# EAGLE design 4P-18650-Mod-PCB (EAGLE 9.5.2)
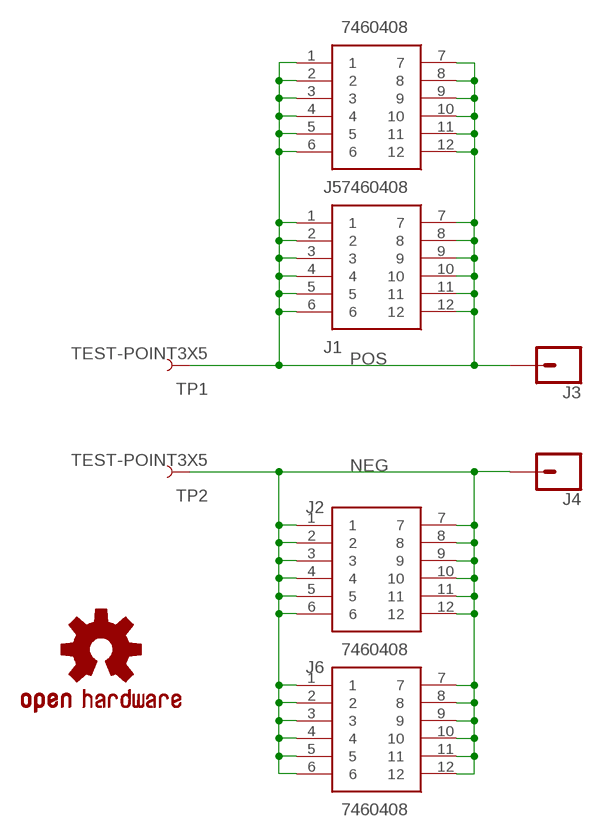
[diagram p0: schematic, sheet 1]

## Parts
J1  7460408  [7460408]
J2  7460408  [7460408]
J3  CONN_01  [1X01]
J4  CONN_01  [1X01]
J5  7460408  [7460408]
J6  7460408  [7460408]
LOGO1  OSHW-LOGOL  [OSHW-LOGO-L]
TP1  TEST-POINT3X5  [PAD.03X.05]
TP2  TEST-POINT3X5  [PAD.03X.05]

## Nets
NEG: J2.1 J2.2 J2.3 J2.4 J2.5 J2.6 J2.7 J2.8 J2.9 J2.10 J2.11 J2.12 J4.1 J6.1 J6.2 J6.3 J6.4 J6.5 J6.6 J6.7 J6.8 J6.9 J6.10 J6.11 J6.12 TP2.P$1
POS: J1.1 J1.2 J1.3 J1.4 J1.5 J1.6 J1.7 J1.8 J1.9 J1.10 J1.11 J1.12 J3.1 J5.1 J5.2 J5.3 J5.4 J5.5 J5.6 J5.7 J5.8 J5.9 J5.10 J5.11 J5.12 TP1.P$1

## Library data of the parts
J1 J2 J5 J6 = SamacSys_Parts:7460408: Wurth Elektronik REDCUBE 12 Pin Power Element, 175A, Press Fit, M5, Vertical Source: Datasheet <https://componentsearchengine.com/Datasheets/1/7460408.pdf>; DESCRIPTION: Wurth Elektronik REDCUBE 12 Pin Power Element, 175A, Press Fit, M5, Vertical; HEIGHT: 6mm; MANUFACTURER_NAME: Wurth Elektronik; MANUFACTURER_PART_NUMBER: 7460408; MOUSER_PART_NUMBER: 710-7460408; MOUSER_PRICE-STOCK: https://www.mouser.com/Search/Refine.aspx?Keyword=710-7460408
J3 J4 = SparkFun-Connectors:CONN_01: Single connection point. Often used as Generic Header-pin footprint for 0.1 inch spaced/style header connections On any of the 0.1 inch spaced packages, you can populate with these: Break Away Headers - Straight <https://www.sparkfun.com/products/116> (PRT-00116) Break Away Male Headers - Right Angle <https://www.sparkfun.com/products/553> (PRT-00553) Female Headers <https://www.sparkfun.com/products/115> (PRT-00115) Break Away Headers - Machine Pin <https://www.sparkfun.com/products/117> (PRT-00117) Break Away Female Headers - Swiss Machine Pin <https://www.sparkfun.com/products/743> (PRT-00743) This device is also useful as a general connection point to wire up your design to another part of your project. Our various solder wires solder well into these plated through hole pads. Hook-Up Wire - Assortment (Stranded, 22 AWG) <https://www.sparkfun.com/products/11375> (PRT-11375) Hook-Up Wire - Assortment (Solid Core, 22 AWG) <https://www.sparkfun.com/products/11367> (PRT-11367) View the entire wire category on our website here <https://www.sparkfun.com/categories/141> Special notes: SMTSO-256-ET is a "flush mount" nut for a 4-40 screw. We mostly use this on specialty testbeds; it is a nice way to connect hardware to your PCB at an adjustable hieght. Also note, the SNAP packages are for using a snappable style connector. We sell a baggie of snaps and they are also used on two LilyPad designs: Snap Assortment - 30 pack (male and female) <https://www.sparkfun.com/products/11347> (DEV-11347) LilyPad Arduino SimpleSnap <https://www.sparkfun.com/products/10941> (DEV-10941) LilyPad SimpleSnap Protoboard <https://www.sparkfun.com/products/10940> (DEV-10940)
LOGO1 = SparkFun-Aesthetics:OSHW-LOGO: Open-Source Hardware (OSHW) Logo This logo indicates the piece of hardware it is found on incorporates a OSHW license and/or adheres to the definition of open source hardware found here: http://freedomdefined.org/OSHW
TP1 TP2 = SparkFun-Connectors:TEST-POINT: SparkFun Test Points Bare copper test points for troubleshooting or In-Circuit-Testing. These are used by our Production team for verifying production board runs using pogo-pins on test beds. SparkFun Products: SparkFun LSM9DS1 Breakout <https://www.sparkfun.com/products/13284> SparkFun PSOC <https://www.sparkfun.com/products/13714> SparkFun Load Cell Amplifier <https://www.sparkfun.com/products/13879>

## Board
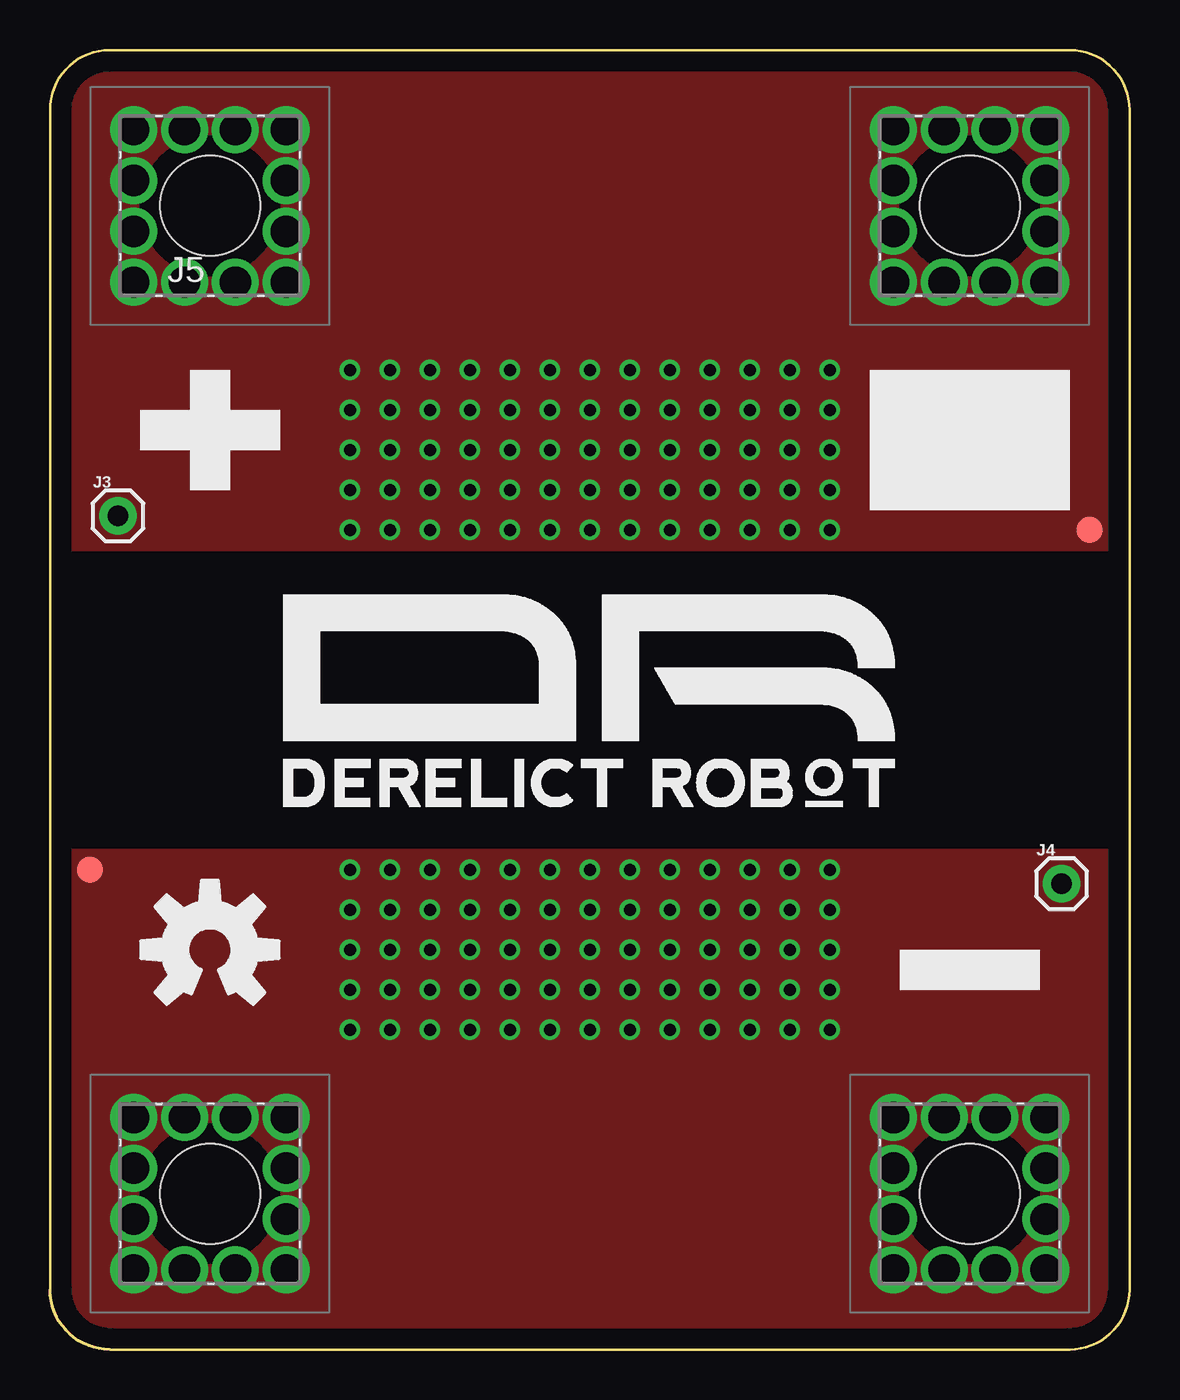
[diagram p1: board, top side]
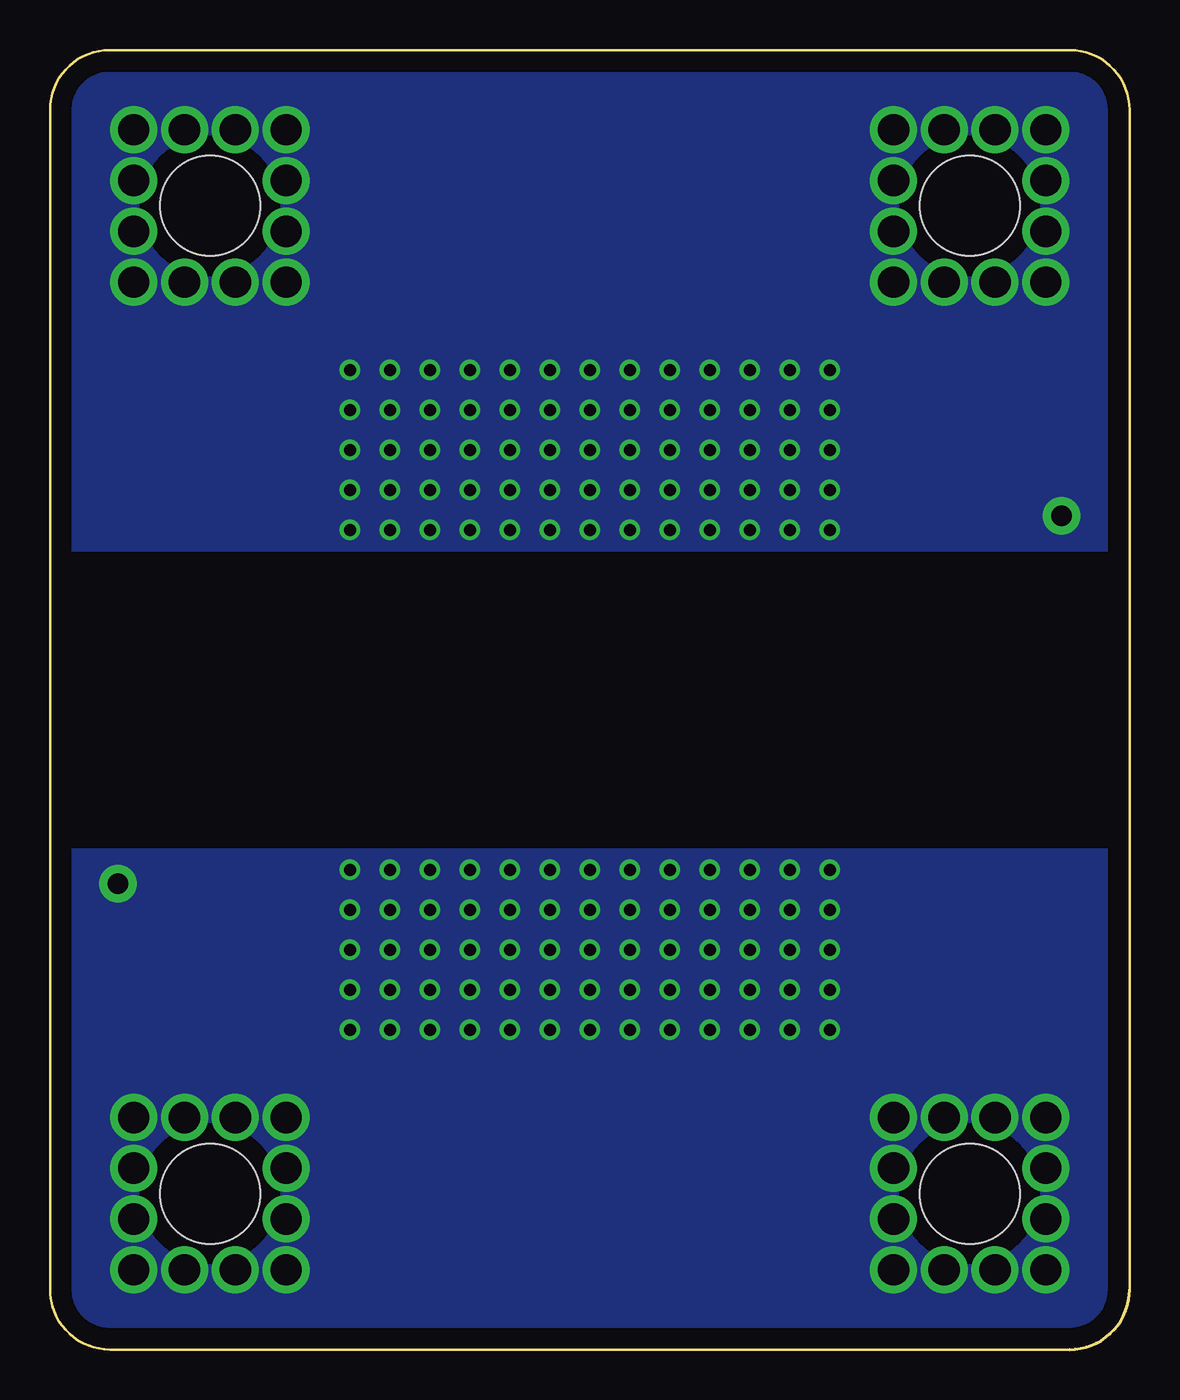
[diagram p2: board, bottom side, seen from below]

Size 54 x 65 mm. Coordinates in mm from the lower left corner, seen from the top.
Outline: 0,62 arc-90 3,65 51,65 arc-90 54,62 54,3 arc-90 51,0 3,0 arc-90 0,3 0,62
Copper layers (1*16): Top 0.035mm / dielectric 1.5mm / Bottom 0.035mm
Design rules "default": minimum track width 6mil, minimum drill 0.35mm, track to track 6mil, track to pad 6mil, pad to pad 6mil, via to via 6mil, smd to smd 6mil, copper to edge 40mil, drill to drill 6mil, minimum pad ring 10mil, minimum via ring 8mil, stop-mask expansion 4mil, vias tented up to drill 0mil, thermal gap 10mil

### Footprints (pad centres in the part's own frame; a part is rotated, then mirrored left to right if it is on the bottom)
7460408 = drill 1.57 pad 2.3: 1 -3.81,-3.81; 2 -1.27,-3.81; 3 1.27,-3.81; 4 3.81,-3.81; 5 3.81,-1.27; 6 3.81,1.27; 7 3.81,3.81; 8 1.27,3.81; 9 -1.27,3.81; 10 -3.81,3.81; 11 -3.81,1.27; 12 -3.81,-1.27 | hole 5: 0,0
1X01 = drill 1.016 pad 1.88: 1 0,0
PAD.03X.05 = smd 1.27 x 1.27: P$1 0,0

### Placement (x,y rotation side)
J1  46,57.2 0 top
J2  46,7.8 180 top
J3  3.4,41.7 0 top
J4  50.6,23.3 0 top
J5  8,57.2 0 top
J6  8,7.8 0 top
LOGO1  8,20 0 top
TP1  52,41 270 top
TP2  2,24 0 top

### Tracks (layer width: path | path; a pad name or v marks a point on that pad's centre or on a via)
NEG  (via drill 0.6)
  other vias: 15,24 15,22 15,20 15,18 15,16 17,16 17,18 17,20 17,22 17,24 19,24 19,22 19,20 19,18 19,16 21,16 21,18 21,20 21,22 21,24 23,24 23,22 23,20 23,18 23,16 25,16 25,18 25,20 25,22 25,24 27,24 27,22 27,20 27,18 27,16 29,16 29,18 29,20 29,22 29,24 31,24 31,22 31,20 31,18 31,16 33,16 33,18 33,20 33,22 33,24 35,24 35,22 35,20 35,18 35,16 37,16 37,18 37,20 37,22 37,24 39,18 39,16 39,24 39,22 39,20
  pour Top (no thermals): -1,25 55,25 55,-1 -1,-1
  pour Bottom (no thermals): -1,25 55,25 55,-1 -1,-1
POS  (via drill 0.6)
  other vias: 39,43 39,49 39,47 39,45 39,41 37,43 37,49 37,47 37,45 37,41 35,43 35,49 35,47 35,45 35,41 33,43 33,49 33,47 33,45 33,41 31,43 31,49 31,47 31,45 31,41 29,43 29,49 29,47 29,45 29,41 27,43 27,49 27,47 27,45 27,41 25,43 25,49 25,47 25,45 25,41 23,43 23,49 23,47 23,45 23,41 21,43 21,49 21,47 21,45 21,41 19,43 19,49 19,47 19,45 19,41 17,43 17,49 17,47 17,45 17,41 15,43 15,49 15,47 15,45 15,41
  pour Top (no thermals): 55,40 55,66 -1,66 -1,40
  pour Bottom (no thermals): -1,66 55,66 55,40 -1,40

### Text on the board
200bmp: C:/Users/andre/Desktop/DR-logo-mono.bmp